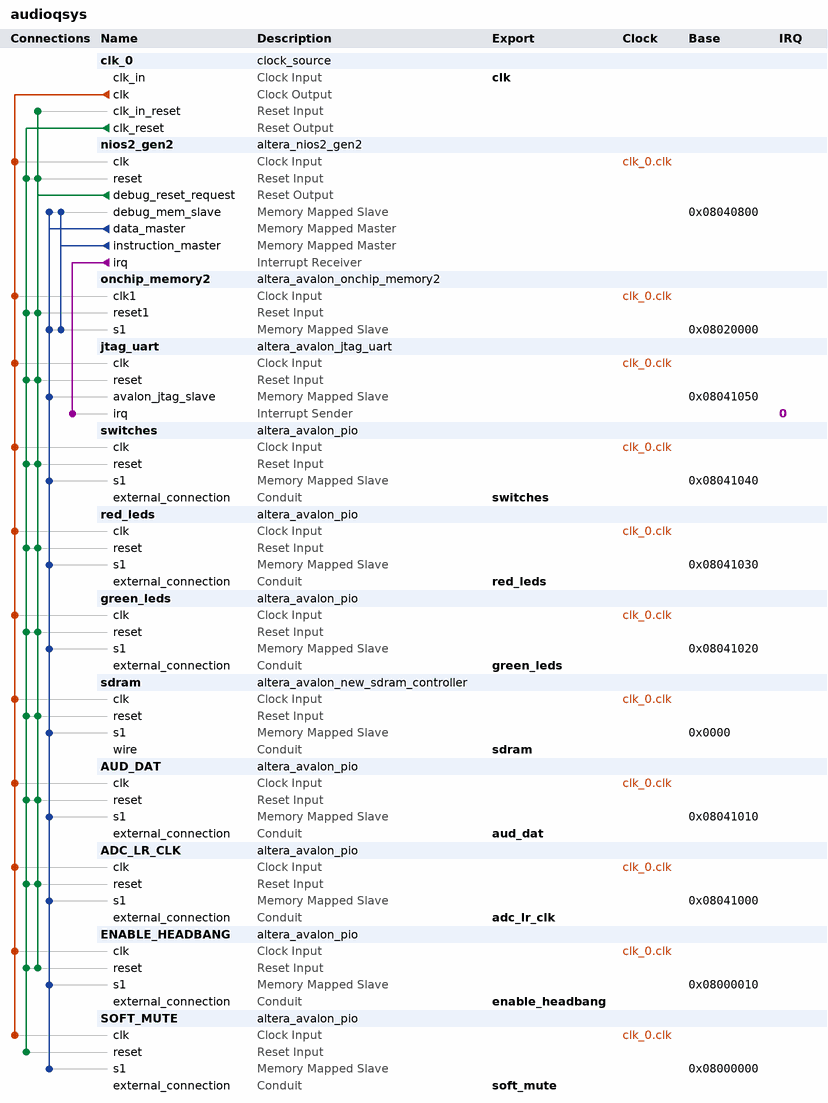
[diagram p0: system contents]
# Platform Designer (Qsys) system audioqsys, Cyclone IV E EP4CE115F29C7
# Parameters at their usual value, and those the tool derives, are not listed.
package require -exact qsys 18.1
create_system audioqsys
set_project_property DEVICE_FAMILY {Cyclone IV E}
set_project_property DEVICE EP4CE115F29C7

add_instance clk_0 clock_source 18.1
set_instance_parameter_value clk_0 clockFrequency 50000000

add_instance nios2_gen2 altera_nios2_gen2 18.1
set_instance_parameter_value nios2_gen2 dcache_size 2048
set_instance_parameter_value nios2_gen2 exceptionSlave onchip_memory2.s1
set_instance_parameter_value nios2_gen2 icache_size 4096
set_instance_parameter_value nios2_gen2 impl Tiny
set_instance_parameter_value nios2_gen2 resetSlave onchip_memory2.s1

add_instance onchip_memory2 altera_avalon_onchip_memory2 18.1
set_instance_parameter_value onchip_memory2 dataWidth 32
set_instance_parameter_value onchip_memory2 dualPort false
set_instance_parameter_value onchip_memory2 initMemContent true
set_instance_parameter_value onchip_memory2 initializationFileName onchip_mem.hex
set_instance_parameter_value onchip_memory2 memorySize 131072

add_instance jtag_uart altera_avalon_jtag_uart 18.1
set_instance_parameter_value jtag_uart simInteractiveOptions NO_INTERACTIVE_WINDOWS

add_instance switches altera_avalon_pio 18.1
set_instance_parameter_value switches direction Input
set_instance_parameter_value switches width 18

add_instance red_leds altera_avalon_pio 18.1
set_instance_parameter_value red_leds direction Output
set_instance_parameter_value red_leds width 18

add_instance green_leds altera_avalon_pio 18.1
set_instance_parameter_value green_leds direction Output
set_instance_parameter_value green_leds width 9

add_instance sdram altera_avalon_new_sdram_controller 18.1
set_instance_parameter_value sdram TAC 5.5
set_instance_parameter_value sdram TRCD 20.0
set_instance_parameter_value sdram TRP 20.0
set_instance_parameter_value sdram casLatency 3
set_instance_parameter_value sdram columnWidth 10
set_instance_parameter_value sdram dataWidth 32
set_instance_parameter_value sdram generateSimulationModel false
set_instance_parameter_value sdram model single_Micron_MT48LC4M32B2_7_chip
set_instance_parameter_value sdram numberOfBanks 4
set_instance_parameter_value sdram numberOfChipSelects 1
set_instance_parameter_value sdram powerUpDelay 100.0
set_instance_parameter_value sdram refreshPeriod 15.625
set_instance_parameter_value sdram rowWidth 13

add_instance AUD_DAT altera_avalon_pio 18.1
set_instance_parameter_value AUD_DAT direction Input
set_instance_parameter_value AUD_DAT width 32

add_instance ADC_LR_CLK altera_avalon_pio 18.1
set_instance_parameter_value ADC_LR_CLK direction Input
set_instance_parameter_value ADC_LR_CLK width 1

add_instance ENABLE_HEADBANG altera_avalon_pio 18.1
set_instance_parameter_value ENABLE_HEADBANG direction Output
set_instance_parameter_value ENABLE_HEADBANG width 1

add_instance SOFT_MUTE altera_avalon_pio 18.1
set_instance_parameter_value SOFT_MUTE direction Output
set_instance_parameter_value SOFT_MUTE width 1

# connections
add_connection clk_0.clk ADC_LR_CLK.clk clock
add_connection clk_0.clk AUD_DAT.clk clock
add_connection clk_0.clk ENABLE_HEADBANG.clk clock
add_connection clk_0.clk green_leds.clk clock
add_connection clk_0.clk jtag_uart.clk clock
add_connection clk_0.clk nios2_gen2.clk clock
add_connection clk_0.clk onchip_memory2.clk1 clock
add_connection clk_0.clk red_leds.clk clock
add_connection clk_0.clk sdram.clk clock
add_connection clk_0.clk SOFT_MUTE.clk clock
add_connection clk_0.clk switches.clk clock
add_connection clk_0.clk_reset ADC_LR_CLK.reset reset
add_connection clk_0.clk_reset AUD_DAT.reset reset
add_connection clk_0.clk_reset ENABLE_HEADBANG.reset reset
add_connection clk_0.clk_reset green_leds.reset reset
add_connection clk_0.clk_reset jtag_uart.reset reset
add_connection clk_0.clk_reset nios2_gen2.reset reset
add_connection clk_0.clk_reset onchip_memory2.reset1 reset
add_connection clk_0.clk_reset red_leds.reset reset
add_connection clk_0.clk_reset sdram.reset reset
add_connection clk_0.clk_reset SOFT_MUTE.reset reset
add_connection clk_0.clk_reset switches.reset reset
add_connection nios2_gen2.debug_reset_request ADC_LR_CLK.reset reset
add_connection nios2_gen2.debug_reset_request AUD_DAT.reset reset
add_connection nios2_gen2.debug_reset_request clk_0.clk_in_reset reset
add_connection nios2_gen2.debug_reset_request ENABLE_HEADBANG.reset reset
add_connection nios2_gen2.debug_reset_request green_leds.reset reset
add_connection nios2_gen2.debug_reset_request jtag_uart.reset reset
add_connection nios2_gen2.debug_reset_request nios2_gen2.reset reset
add_connection nios2_gen2.debug_reset_request onchip_memory2.reset1 reset
add_connection nios2_gen2.debug_reset_request red_leds.reset reset
add_connection nios2_gen2.debug_reset_request sdram.reset reset
add_connection nios2_gen2.debug_reset_request switches.reset reset
add_connection nios2_gen2.data_master ADC_LR_CLK.s1 avalon
set_connection_parameter_value nios2_gen2.data_master/ADC_LR_CLK.s1 baseAddress 0x08041000
add_connection nios2_gen2.data_master AUD_DAT.s1 avalon
set_connection_parameter_value nios2_gen2.data_master/AUD_DAT.s1 baseAddress 0x08041010
add_connection nios2_gen2.data_master ENABLE_HEADBANG.s1 avalon
set_connection_parameter_value nios2_gen2.data_master/ENABLE_HEADBANG.s1 baseAddress 0x08000010
add_connection nios2_gen2.data_master green_leds.s1 avalon
set_connection_parameter_value nios2_gen2.data_master/green_leds.s1 baseAddress 0x08041020
add_connection nios2_gen2.data_master jtag_uart.avalon_jtag_slave avalon
set_connection_parameter_value nios2_gen2.data_master/jtag_uart.avalon_jtag_slave baseAddress 0x08041050
add_connection nios2_gen2.data_master nios2_gen2.debug_mem_slave avalon
set_connection_parameter_value nios2_gen2.data_master/nios2_gen2.debug_mem_slave baseAddress 0x08040800
add_connection nios2_gen2.data_master onchip_memory2.s1 avalon
set_connection_parameter_value nios2_gen2.data_master/onchip_memory2.s1 baseAddress 0x08020000
add_connection nios2_gen2.data_master red_leds.s1 avalon
set_connection_parameter_value nios2_gen2.data_master/red_leds.s1 baseAddress 0x08041030
add_connection nios2_gen2.data_master sdram.s1 avalon
set_connection_parameter_value nios2_gen2.data_master/sdram.s1 baseAddress 0x0000
add_connection nios2_gen2.data_master SOFT_MUTE.s1 avalon
set_connection_parameter_value nios2_gen2.data_master/SOFT_MUTE.s1 baseAddress 0x08000000
add_connection nios2_gen2.data_master switches.s1 avalon
set_connection_parameter_value nios2_gen2.data_master/switches.s1 baseAddress 0x08041040
add_connection nios2_gen2.instruction_master nios2_gen2.debug_mem_slave avalon
set_connection_parameter_value nios2_gen2.instruction_master/nios2_gen2.debug_mem_slave baseAddress 0x08040800
add_connection nios2_gen2.instruction_master onchip_memory2.s1 avalon
set_connection_parameter_value nios2_gen2.instruction_master/onchip_memory2.s1 baseAddress 0x08020000
add_connection nios2_gen2.irq jtag_uart.irq interrupt
set_connection_parameter_value nios2_gen2.irq/jtag_uart.irq irqNumber 0

# exported interfaces
add_interface adc_lr_clk conduit end
set_interface_property adc_lr_clk EXPORT_OF ADC_LR_CLK.external_connection
add_interface aud_dat conduit end
set_interface_property aud_dat EXPORT_OF AUD_DAT.external_connection
add_interface clk clock sink
set_interface_property clk EXPORT_OF clk_0.clk_in
add_interface enable_headbang conduit end
set_interface_property enable_headbang EXPORT_OF ENABLE_HEADBANG.external_connection
add_interface green_leds conduit end
set_interface_property green_leds EXPORT_OF green_leds.external_connection
add_interface red_leds conduit end
set_interface_property red_leds EXPORT_OF red_leds.external_connection
add_interface sdram conduit end
set_interface_property sdram EXPORT_OF sdram.wire
add_interface soft_mute conduit end
set_interface_property soft_mute EXPORT_OF SOFT_MUTE.external_connection
add_interface switches conduit end
set_interface_property switches EXPORT_OF switches.external_connection

set_interconnect_requirement {$system} qsys_mm.clockCrossingAdapter HANDSHAKE
set_interconnect_requirement {$system} qsys_mm.enableEccProtection FALSE
set_interconnect_requirement {$system} qsys_mm.insertDefaultSlave FALSE
set_interconnect_requirement {$system} qsys_mm.maxAdditionalLatency 1

save_system audioqsys.qsys
